# EAGLE schematic breakout_board (EAGLE 6.6.0)
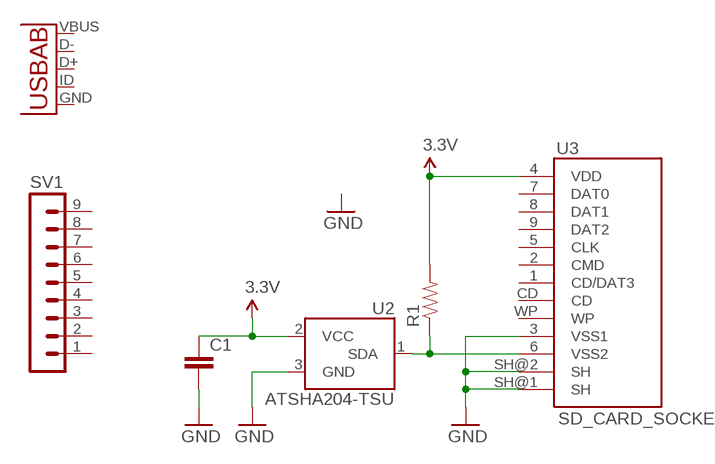
[diagram p0: schematic, sheet 1]

## Parts
C1  C-EUC0402  [C0402]
R1  RESISTOR0603  [0603-RES]
SV1  MA09-1  [MA09-1]
U1  USB-AB"  [USB_AB_MICRO_1:1_V2]
U2  ATSHA204-TSU  [SOT23-3]
U3  SD_CARD_SOCKET  [SD_1:1]

## Nets
3.3V: C1.1 R1.2 U2.2(VCC) U3.4(VDD)
GND: C1.2 U2.3(GND) U3.3(VSS1) U3.SH@1(SH) U3.SH@2(SH)
N$1: R1.1 U2.1(SDA) U3.6(VSS2)
Unconnected: SV1.1 SV1.2 SV1.3 SV1.4 SV1.5 SV1.6 SV1.7 SV1.8 SV1.9 U1.D+ U1.D- U1.GND U1.ID(USBID) U1.VBUS U3.1(CD/DAT3) U3.2(CMD) U3.5(CLK) U3.7(DAT0) U3.8(DAT1) U3.9(DAT2) U3.CD U3.WP

## Library data of the parts
C1 = resistor:C-EU: CAPACITOR, European symbol
R1 = SparkFun-Resistors:RESISTOR: Resistor Basic schematic elements and footprints for 0603, 1206, and PTH resistors.
SV1 = con-lstb:MA09-1: PIN HEADER; OC_FARNELL: unknown; OC_NEWARK: unknown
U1 = SparkFun-Connectors:USB-AB: This is a USB AB connector that is compatible with USB OTG. i.e. this connector can serve as a host or device
U2 = SparkFun-DigitalIC:ATSHA204: Atmel ATSHA204 The Atmel ATSHA204 is an optimized authentication chip that includes a 4.5Kb EEPROM. This array can be used for storage of keys, miscellaneous read/write, read-only, password or secret data, and consumption tracking. Access to the various sections of memory can be restricted in a variety of ways and then the configuration locked to prevent changes.
U3 = SparkFun-Connectors:SD_CARD_SOCKET: SD Memory Card Connector, push-push normal type, CD enable, WP enable